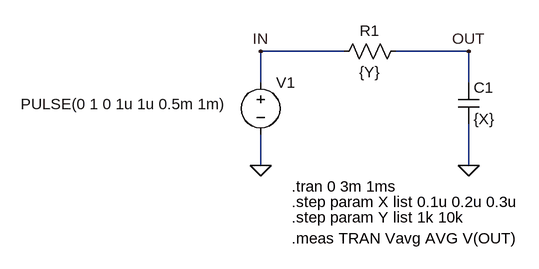
[diagram p0: schematic Measure_Average.asc]
Measure_Average.asc, the LTspice schematic file:
Version 4
SHEET 1 880 680
WIRE 192 64 64 64
WIRE 384 64 272 64
WIRE 64 112 64 64
WIRE 384 112 384 64
WIRE 64 240 64 192
WIRE 384 240 384 176
FLAG 64 240 0
FLAG 384 240 0
FLAG 64 64 IN
FLAG 384 64 OUT
SYMBOL voltage 64 96 R0
WINDOW 3 -369 49 Left 2
WINDOW 123 0 0 Left 0
WINDOW 39 0 0 Left 0
SYMATTR InstName V1
SYMATTR Value PULSE(0 1 0 1u 1u 0.5m 1m)
SYMBOL res 288 48 R90
WINDOW 0 0 56 VBottom 2
WINDOW 3 32 56 VTop 2
SYMATTR InstName R1
SYMATTR Value {Y}
SYMBOL cap 368 112 R0
SYMATTR InstName C1
SYMATTR Value {X}
TEXT 112 272 Left 2 !.tran 0 3m 1ms
TEXT 112 296 Left 2 !.step param X list 0.1u 0.2u 0.3u
TEXT 112 320 Left 2 !.step param Y list 1k 10k
TEXT 112 352 Left 2 !.meas TRAN Vavg AVG V(OUT)

The netlist it stands for:
* Measure_Average.asc
V1 IN 0 PULSE(0 1 0 1u 1u 0.5m 1m)
R1 OUT IN {Y}
C1 OUT 0 {X}
.tran 0 3m 1ms
.step param X list 0.1u 0.2u 0.3u
.step param Y list 1k 10k
.meas TRAN Vavg AVG V(OUT)
.backanno
.end

* Results of the author's LTspice run, read from the files saved beside the schematic
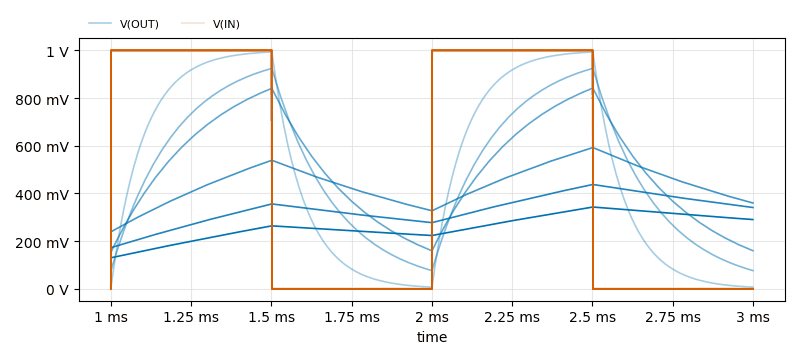
[diagram p1: Transient Analysis of Measure_Average.asc, plotted from the saved traces]
* Transient Analysis, 6 runs:
*   V(OUT) [x=1e-007 y=1000]: min 6.792 mV, max 993.3 mV, average 501 mV, rms 634.5 mV, last 6.792 mV
*   V(OUT) [x=2e-007 y=1000]: min 75.94 mV, max 924.4 mV, average 501 mV, rms 576 mV, last 76.46 mV
*   V(OUT) [x=3e-007 y=1000]: min 154.1 mV, max 841.5 mV, average 500.2 mV, rms 544.1 mV, last 159.8 mV
*   V(OUT) [x=1e-007 y=10000]: min 239.4 mV, max 592.2 mV, average 440.8 mV, rms 448.5 mV, last 359.8 mV
*   V(OUT) [x=2e-007 y=10000]: min 172.7 mV, max 437.4 mV, average 332.7 mV, rms 338.9 mV, last 341 mV
*   V(OUT) [x=3e-007 y=10000]: min 130.3 mV, max 342.9 mV, average 260.7 mV, rms 266.6 mV, last 290.5 mV
*   V(IN) [x=1e-007 y=1000]: min 0 V, max 1 V, average 501 mV, rms 707.6 mV, last 0 V
*   V(IN) [x=2e-007 y=1000]: min 0 V, max 1 V, average 501 mV, rms 707.6 mV, last 0 V
*   V(IN) [x=3e-007 y=1000]: min 0 V, max 1 V, average 501 mV, rms 707.7 mV, last 0 V
*   V(IN) [x=1e-007 y=10000]: min 0 V, max 1 V, average 501 mV, rms 707.8 mV, last 0 V
*   V(IN) [x=2e-007 y=10000]: min 0 V, max 1 V, average 501 mV, rms 707.7 mV, last 0 V
*   V(IN) [x=3e-007 y=10000]: min 0 V, max 1 V, average 501 mV, rms 707.7 mV, last 0 V
* From the log:
*   Measurement: vavg
*     step  AVG(v(out))  FROM  TO
*        1  0.501032  0  0.002
*        2  0.501014  0  0.002
*        3  0.500225  0  0.002
*        4  0.440786  0  0.002
*        5  0.332725  0  0.002
*        6  0.260724  0  0.002